# EAGLE design Tasmodul_USB-Dimmer (EAGLE 9.6.2)
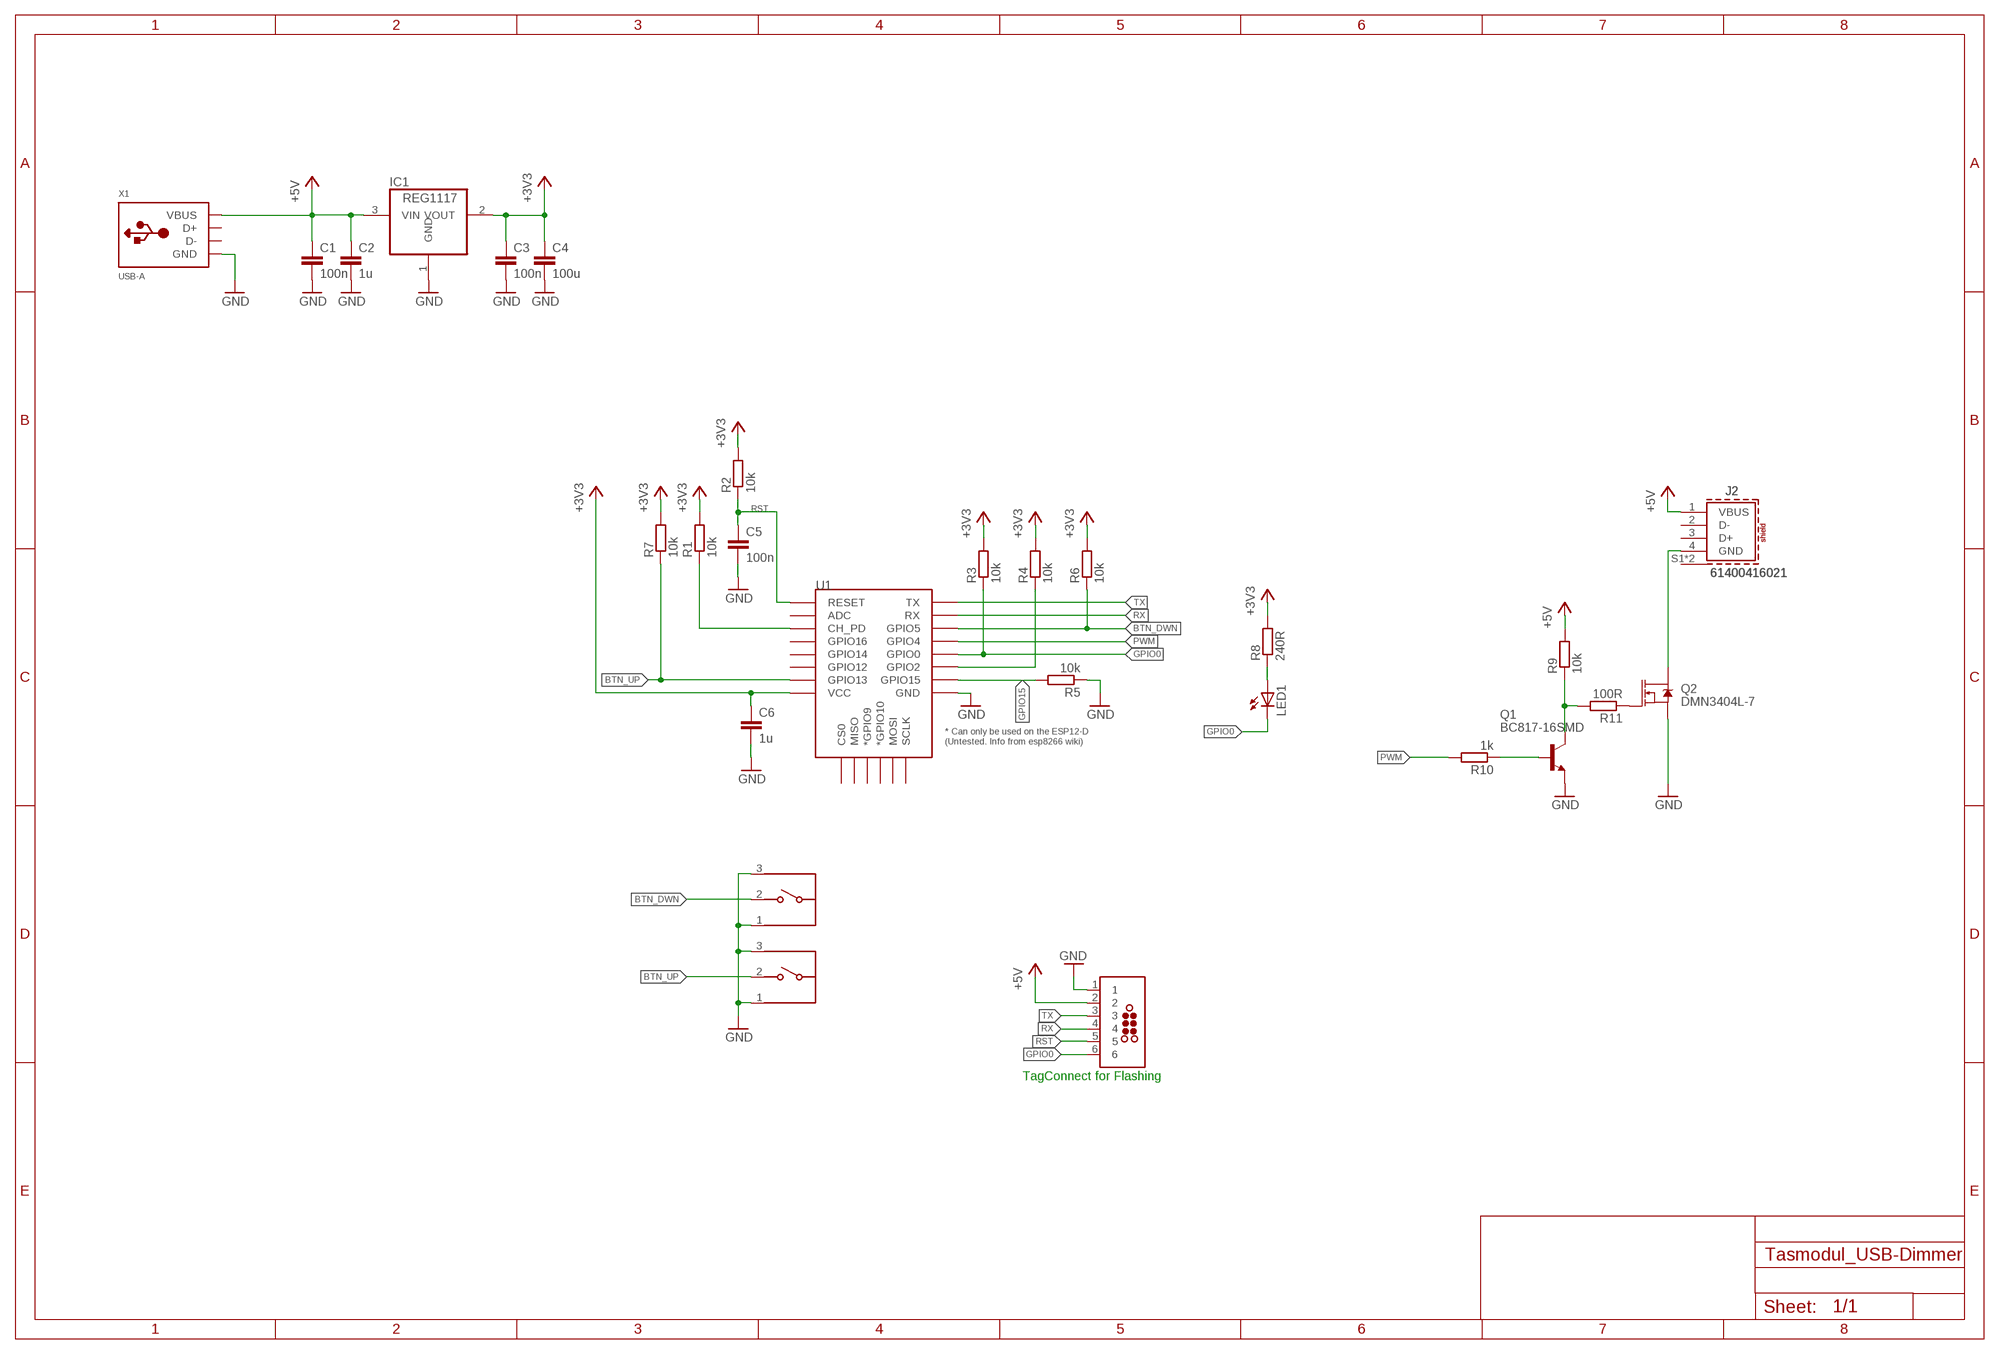
[diagram p0: schematic, sheet 1]

## Parts
C1  100n  C-EUC0603  [C0603]
C2  1u  C-EUC0603  [C0603]
C3  100n  C-EUC0603  [C0603]
C4  100u  C-EUC0603  [C0603]
C5  100n  C-EUC0603  [C0603]
C6  1u  C-EUC0603  [C0603]
IC1  REG1117  [SOT223]
J2  61400416021  61400416021  [61400416021]
J6  TC2030-MCP-NL  [TC2030-MCP-NL]
LED1  LEDCHIP-LED0603  [CHIP-LED0603]
Q1  BC817-16SMD  [SOT23-BEC]
Q2  DMN3404L-7  MOSFET-NCH-AO3404A  [SOT23-3]
R1  10k  R-EU_R0603  [R0603]
R2  10k  R-EU_R0603  [R0603]
R3  10k  R-EU_R0603  [R0603]
R4  10k  R-EU_R0603  [R0603]
R5  10k  R-EU_R0603  [R0603]
R6  10k  R-EU_R0603  [R0603]
R7  10k  R-EU_R0603  [R0603]
R8  240R  R-EU_R0603  [R0603]
R9  10k  R-EU_R0603  [R0603]
R10  1k  R-EU_R0603  [R0603]
R11  100R  R-EU_R0603  [R0603]
S1  436333033816  [436333033816]
S2  436333033816  [436333033816]
U1  ESP12ESMD  [ESP12E-SMD]
X1  USB-A  [MOLEX_480371000]

## Nets
+3V3: C3.1 C4.1 C6.1 IC1.2(VOUT) R1.2 R2.2 R3.2 R4.2 R6.2 R7.2 R8.2 U1.VCC
+5V: C1.1 C2.1 IC1.3(VIN) J2.1(VBUS) J6.2 R9.2 X1.1(VBUS)
BTN_DWN: R6.1 S2.2 U1.GPIO5
BTN_UP: R7.1 S1.2 U1.GPIO13
GND: C1.2 C2.2 C3.2 C4.2 C5.2 C6.2 IC1.1(GND) J6.1 Q1.E Q2.2(S) R5.1 S1.1 S1.3 S2.1 S2.3 U1.GND X1.4(GND)
GPIO0: J6.6 LED1.C R3.1 U1.GPIO0
GPIO15: R5.2 U1.GPIO15
N$1: LED1.A R8.1
N$3: Q2.1(G) R11.1
N$4: Q1.B R10.1
N$5: R1.1 U1.CH_PD
N$7: R4.1 U1.GPIO2
N$8: Q1.C R9.1 R11.2
N$9: J2.4(GND) Q2.3(D)
PWM: R10.2 U1.GPIO4
RST: C5.1 J6.5 R2.1 U1.RESET
RX: J6.4 U1.RXD0(RX)
TX: J6.3 U1.TXD0(TX)
Unconnected: J2.2(D-) J2.3(D+) J2.S1(SHIELD) J2.S2(SHIELD) U1.ADC U1.CS0 U1.GPIO9(*GPIO9) U1.GPIO10(*GPIO10) U1.GPIO12 U1.GPIO14 U1.GPIO16 U1.MISO U1.MOSI U1.SCLK X1.2(D-) X1.3(D+)

## Notes on the sheet
- TagConnect for Flashing

## Library data of the parts
C1-C6 = rcl:C-EU: CAPACITOR, European symbol
IC1 = burr-brown:REG1117: 800mA and 1A Low Dropout (LDO) Positive Regulator 1.8V, 2.5V, 2.85V, 3.3V, 5V, and Adj; MPN: REG1117; OC_FARNELL: 1097566; OC_NEWARK: 14P6981
J2 = Wurth_Connectors_WR-USB:61400416021: WR-COM USB 2.0 Type A Horizontal Kind Properties Durability:1 500 Mating cycles Quality Class:1 500 Mating cycles Connector Type:USB Gender:Receptacle Type:Horizontal General Information Operating Temperature:-40up to +105 °C Compliance:RoHS Electrical Properties IR 1:1.5 A Working Voltage:30V (AC) Withstanding Voltage:750 V (AC) Contact Resistance:20 mΩ Material Properties Insulator Material:PBT Insulator Flammability Rating:UL94 V-0 Color:White Cover Material:Brass Cover Plating:Nickel Contact Material:Copper Alloy Contact Plating:Selective Gold Contact Type:Stamped Shielding Material:Brass Shielding Plating:Nickel <https://www.we-online.com/catalog/media/o32983v209%20Family_WR-COM_61400416021.jpg> Details see: https://www.we-online.com/catalog/en/COM_TYPE_A_HORIZONTAL/ Updated by Yingchun, Shan 2020-01-14 2020 (C) Würth Elektronik; APPLICATION: USB 2.0; DATASHEET-URL: https://www.we-online.com/redexpert/spec/61400416021?ae; GERDER: Receptacle; INTERFACE-TYPE: Type A; IR: 1.5A; MOUNT: THT; PACKAGING: Tray; PART-NUMBER: 61400416021; PINS: 4; TYPE: Horizontal; WORKING-VOLTAGE: 30V(AC)
J6 = tag-connect:TC2030: TAG-CONNECT ICSP Connector Manufacturer: Tag-Connect <http://www.tag-connect.com> Cable for easy In-Circuit Serial Programming. Designed for Microchip ICD2, suitable for many others. Two variants - one "with legs" (for hands-free fit on PCB) and another "without legs" for quick programming. PAD Description 1 MCLR/Vpp 2 Vdd 3 GND 4 PGD (ISPDAT) 5 PGC (ISPCLK) 6 nc (used for LVP) ©2009 ROFA.cz - modified and updated by Robert Darlington ‹rdarlington@gmail.com›
LED1 = led:LED: LED OSRAM: - CHIPLED LG R971, LG N971, LY N971, LG Q971, LY Q971, LO R971, LY R971 LH N974, LH R974 LS Q976, LO Q976, LY Q976 LO Q996 - Hyper CHIPLED LW Q18S LB Q993, LB Q99A, LB R99A - SideLED LS A670, LO A670, LY A670, LG A670, LP A670 LB A673, LV A673, LT A673, LW A673 LH A674 LY A675 LS A676, LA A676, LO A676, LY A676, LW A676 LS A679, LY A679, LG A679 - Hyper Micro SIDELED® LS Y876, LA Y876, LO Y876, LY Y876 LT Y87S - SmartLED LW L88C, LW L88S LB L89C, LB L89S, LG L890 LS L89K, LO L89K, LY L89K LS L896, LA L896, LO L896, LY L896 - TOPLED LS T670, LO T670, LY T670, LG T670, LP T670 LSG T670, LSP T670, LSY T670, LOP T670, LYG T670 LG T671, LOG T671, LSG T671 LB T673, LV T673, LT T673, LW T673 LH T674 LS T676, LA T676, LO T676, LY T676, LB T676, LH T676, LSB T676, LW T676 LB T67C, LV T67C, LT T67C, LS T67K, LO T67K, LY T67K, LW E67C LS E67B, LA E67B, LO E67B, LY E67B, LB E67C, LV E67C, LT E67C LW T67C LS T679, LY T679, LG T679 LS T770, LO T770, LY T770, LG T770, LP T770 LB T773, LV T773, LT T773, LW T773 LH T774 LS E675, LA E675, LY E675, LS T675 LS T776, LA T776, LO T776, LY T776, LB T776 LHGB T686 LT T68C, LB T68C - Hyper Mini TOPLED® LB M676 - Mini TOPLED Santana® LG M470 LS M47K, LO M47K, LY M47K Source: http://www.osram.convergy.de LUXEON: - LUMILED® LXK2-PW12-R00, LXK2-PW12-S00, LXK2-PW14-U00, LXK2-PW14-V00 LXK2-PM12-R00, LXK2-PM12-S00, LXK2-PM14-U00 LXK2-PE12-Q00, LXK2-PE12-R00, LXK2-PE12-S00, LXK2-PE14-T00, LXK2-PE14-U00 LXK2-PB12-K00, LXK2-PB12-L00, LXK2-PB12-M00, LXK2-PB14-N00, LXK2-PB14-P00, LXK2-PB14-Q00 LXK2-PR12-L00, LXK2-PR12-M00, LXK2-PR14-Q00, LXK2-PR14-R00 LXK2-PD12-Q00, LXK2-PD12-R00, LXK2-PD12-S00 LXK2-PH12-R00, LXK2-PH12-S00 LXK2-PL12-P00, LXK2-PL12-Q00, LXK2-PL12-R00 Source: www.luxeon.com KINGBRIGHT: KA-3528ASYC Source: www.kingbright.com
Q1 = transistor-npn:BC817*: NPN Transistor
Q2 = SparkFun-DiscreteSemi:MOSFET-NCH: N-channel MOSFETs Voltage controlled devices that allow control of high current outputs. SparkFun Products: SparkFun OpenScale <https://www.sparkfun.com/products/13261> SparkFun Digital Sandbox <https://www.sparkfun.com/products/12651> SparkFun Monster Moto Shield <https://www.sparkfun.com/products/10182> SparkFun MOSFET Power Controller <https://www.sparkfun.com/products/11214>; PROD_ID: TRANS-12988; VALUE: 5.8A/30V/35mΩ
R1-R11 = rcl:R-EU_: RESISTOR, European symbol
S1 S2 = Wurth_Switch_WS-TASU:436333033816: WS-TASU J-Bend SMT Tact Switch with Boss Design 4.5 x 3.4mm side push MATERIAL PROPERTIES Cover Material Copper Alloy PROPERTIES Actuator Material HTN Actuator Flammability Rating UL94 V-0 Actuator Color Black Frame Material HTN Frame Flammability Rating UL94 V-0 Frame Color Black Contact Material Stainless Steel Contact Plating Silver Terminal Material Copper Alloy Terminal Plating Silver VR 12 V (DC) Contact Resistance Initial 500 mΩ Contact Resistance After Life Test 2 Ω RISO 100 MΩ Withstanding Voltage 250 V (AC) Washable No Mechanical Properties Electrical Life 100000 Cycles Stroke (Value) 0.2 mm GENERAL INFORMATION Operating Temperature -40 up to +85 °C Washable No PACKAGING PROPERTIES Packaging Tape and Reel <https://www.we-online.de/katalog/media/o64618v209%20Family_WS-TASU_J-Bend_SMD_Tact_Switch_with_boss_design_436353045816.jpg> Details see: https://www.we-online.de/katalog/en/WS-TASU_J-BEND_SMT_TACT_SWITCH_SIDE_PUSH Updated by Ella Wu 2021-01-25 2021(C) Wurth Elektronik; DATASHEET-URL: https://www.we-online.com/catalog/datasheet/436333033816.pdf; H: 3.3mm; OPERATION-FORCE: 160g; PART-NUMBER: 436333033816
U1 = esp8266modules:ESP12E: ESP12E Module
X1 = adafruit:USB-A: USB type A 'plug' Used for things that can directly connect to a USB port, say USB key

## Board
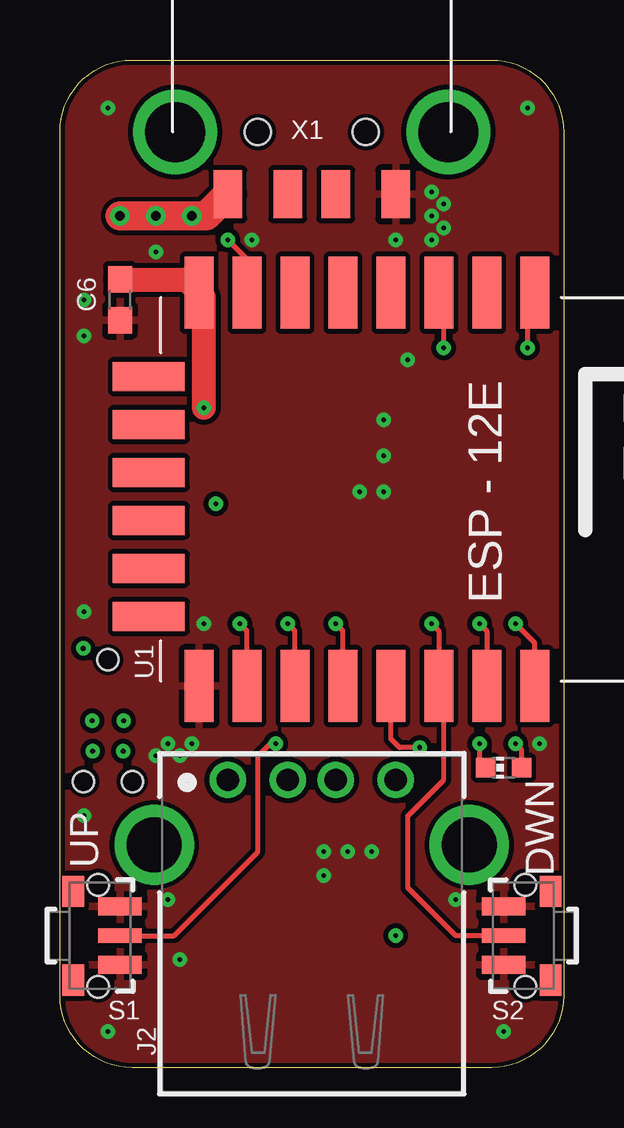
[diagram p1: board, top side]
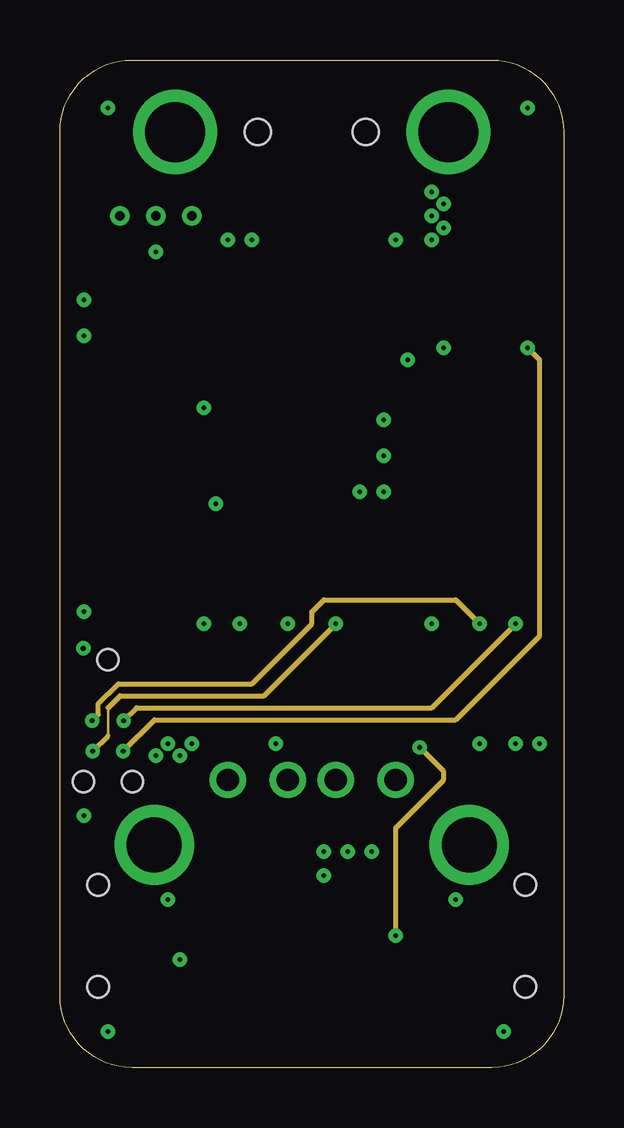
[diagram p2: board, inner layer Route2-SIG]
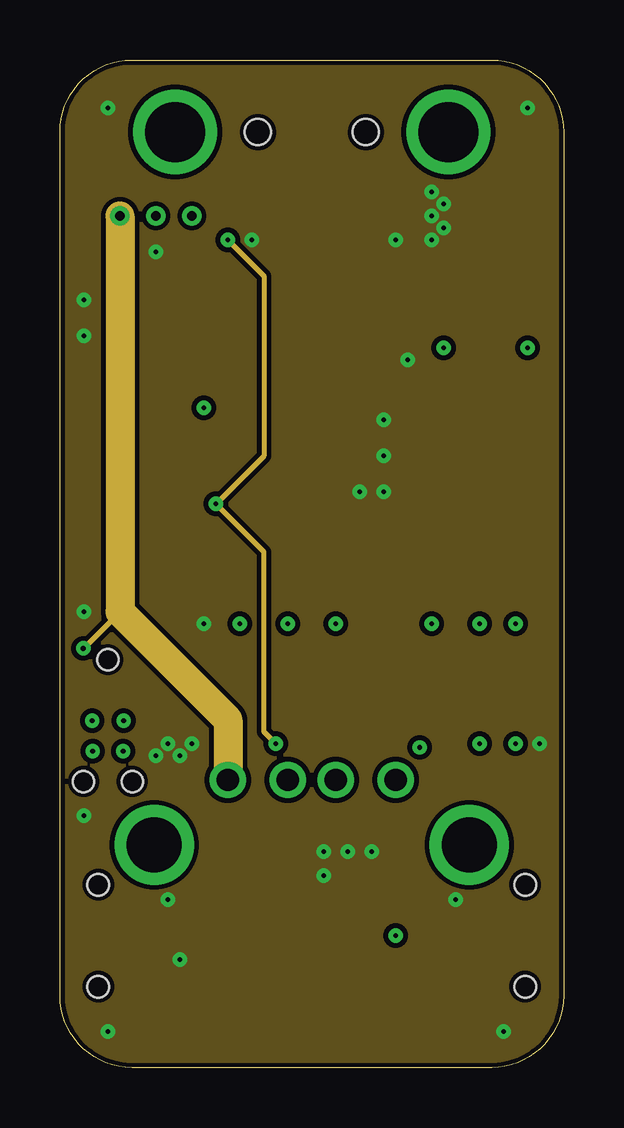
[diagram p3: board, inner layer Route15-PWR]
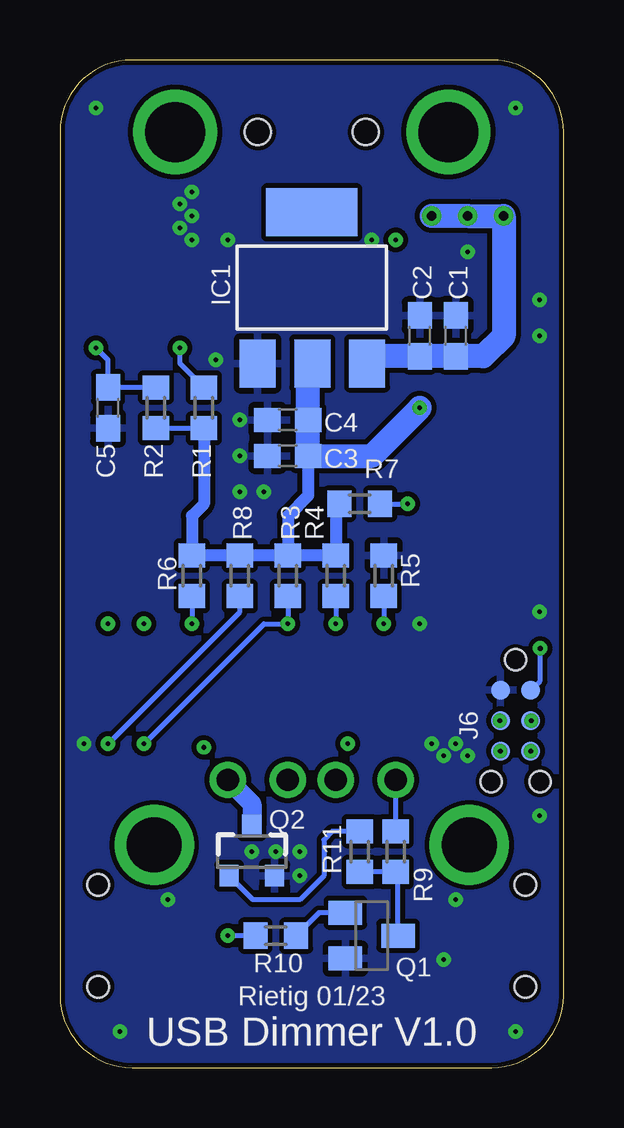
[diagram p4: board, bottom side, seen from below]

Size 21 x 42 mm. Coordinates in mm from the lower left corner, seen from the top.
Outline: 3,42 18,42 arc-90 21,39 21,3 arc-90 18,0 3,0 arc-90 0,3 0,39 arc-90 3,42
Copper layers (1+2*15+16): Top 0.035mm / dielectric 0.2mm / Route2-SIG 0.0175mm / dielectric 1.065mm / Route15-PWR 0.0175mm / dielectric 0.2mm / Bottom 0.035mm
Design rules "jlcpcb-4layers_seb *": minimum track width 3.5mil, minimum drill 0.2mm, track to track 8mil, track to pad 0.2mm, pad to pad 5mil, via to via 10mil, smd to smd 0mil, copper to edge 0.2mm, drill to drill 8mil, minimum pad ring 0.3mm, minimum via ring 0.2mm, stop-mask expansion 2mil, vias tented up to drill 20mil, thermal gap 10mil

### Footprints (pad centres in the part's own frame; a part is rotated, then mirrored left to right if it is on the bottom)
C0603 = smd 1.1 x 1: 1 -0.85,0; 2 0.85,0
SOT223 = smd 1.499 x 2.007: 1 -2.261,-3.15; 2 0.025,-3.15; 3 2.311,-3.15 | smd 3.81 x 2.007: 4 0,3.15
61400416021 = drill 0.92: 1 -3.5,5.99; 2 -1,5.99; 3 1,5.99; 4 3.5,5.99 | drill 2.3: S1 -6.57,3.28; S2 6.57,3.28
TC2030-MCP-NL = smd 0.787 x 0.787: 1 1.27,-0.635; 2 1.27,0.635; 3 2.54,-0.635; 4 2.54,0.635; 5 3.81,-0.635; 6 3.81,0.635 | hole 0.889: 0,0; 5.08,-1.016; 5.08,1.016
CHIP-LED0603 = smd 0.8 x 0.8: A 0,-0.75; C 0,0.75
SOT23-BEC = smd 1 x 1.4: B -0.95,-1.1; C 0,1.1; E 0.95,-1.1
SOT23-3 = smd 0.8 x 0.9: 1 -0.95,-1; 2 0.95,-1; 3 0,1.1
R0603 = smd 1 x 1.1: 1 -0.85,0; 2 0.85,0
436333033816 = smd 0.75 x 1.8: 1 -1.225,0.9; 3 1.225,0.9 | smd 0.6 x 1.8: 2 0,0.9 | smd 1.3 x 0.9: Z1 -1.85,-1.05; Z2 1.85,-1.05 | hole 0.9: -2.125,0; 2.125,0
ESP12E-SMD = smd 3 x 1.2: ADC -8.3,3.8; CH_PD -8.3,1.8; GND 8.1,-8.2; GPIO0 8.1,-2.2; GPIO2 8.1,-4.2; GPIO4 8.1,-0.2; GPIO5 8.1,1.8; GPIO12 -8.3,-4.2; GPIO13 -8.3,-6.2; GPIO14 -8.3,-2.2; GPIO15 8.1,-6.2; GPIO16 -8.3,-0.2; RESET -8.3,5.8; RXD0 8.1,3.8; TXD0 8.1,5.8; VCC -8.3,-8.2 | smd 1.2 x 3: CS0 -4.8,-10.3; GPIO9 -0.8,-10.3; GPIO10 1.2,-10.3; MISO -2.8,-10.3; MOSI 3.2,-10.3; SCLK 5.2,-10.3
MOLEX_480371000 = smd 1.2 x 2: 1 3.5,2.6; 2 1,2.6; 3 -1,2.6; 4 -3.5,2.6 | drill 2.5: M1 -5.7,0; M2 5.7,0 | hole 1.1: -2.25,0; 2.25,0

### Placement (x,y rotation side)
C1  4.5,30.5 90 bottom
C2  6,30.5 90 bottom
C3  11.5,25.5 180 bottom
C4  11.5,27 180 bottom
C5  19,27.5 270 bottom
C6  2.5,32 270 top
IC1  10.5,32.5 0 bottom
J2  10.5,6 0 top
J6  2,17 270 bottom
LED1  18.5,12.5 90 top
Q1  8,5.5 270 bottom
Q2  13,9 0 bottom
R1  15,27.5 270 bottom
R2  17,27.5 270 bottom
R3  11.5,20.5 90 bottom
R4  9.5,20.5 90 bottom
R5  7.5,20.5 270 bottom
R6  15.5,20.5 90 bottom
R7  8.5,23.5 180 bottom
R8  13.5,20.5 90 bottom
R9  7,9 90 bottom
R10  12,5.5 180 bottom
R11  8.5,9 270 bottom
S1  1.6,5.5 270 top
S2  19.4,5.5 90 top
U1  14,24 270 top
X1  10.5,39 180 top

### Tracks (layer width: path | path; a pad name or v marks a point on that pad's centre or on a via)
+3V3  (via drill 0.2)
  Top 1: v6,27.5 6,32.1 U1.VCC 5.25,32.85 C6.1
  Bottom 0.2: R2.2 R1.2
  Bottom 0.5: R3.2 R4.2 9.5,23.35 R7.2 | R3.2 R8.2 R6.2 15.5,23 15,23.5 R1.2 | C3.1 10.65,23.85 11.5,23 R3.2
  Bottom 1: IC1.2 10.65,29.18 C4.1 C3.1 8,25.5 v6,27.5
+5V  (via drill 0.2, 0.4)
  Top 1.2: X1.1 6.1,35.5 v2.5,35.5
  Route15-PWR 0.2: v0.97,17.47 0.98,17.47 2.5,18.99
  Route15-PWR 1.2: v2.5,35.5 2.5,18.99 7,14.49 J2.1
  Bottom 0.2: J6.2 0.97,16.12 v0.97,17.47 | R9.2 J2.1
  Bottom 1: IC1.3 7.89,29.65 C2.1 C1.1 3.35,29.65 2.5,30.5 v2.5,35.5 v4,35.5 v5.5,35.5
BTN_DWN  (via drill 0.2)
  Top 0.2: S2.2 16.5,5.5 14.5,7.5 14.5,10.5 16,12 16,15.7 U1.GPIO5 15.8,18.2 v15.5,18.5
  Bottom 0.2: R6.1 v15.5,18.5
BTN_UP  (via drill 0.2)
  Top 0.2: S1.2 4.75,5.5 8.25,9 8.25,13 8.75,13.5 v9,13.5 | v7,34.5 7.8,33.7 U1.GPIO13
  Route15-PWR 0.2: v9,13.5 8.5,14 8.5,21.5 v6.5,23.5 8.5,25.5 8.5,33 v7,34.5
  Bottom 0.2: R7.1 v6.5,23.5
GND  (via drill 0.2)
  other vias: 15.5,36.5 15.5,35.5 13,9 12,9 4,34 8,34.5 14,34.5 11,9 11,8 1,10.5 1,19 6,18.5 5,13 4,13 4.5,7 16.5,7 13.5,27 13.5,25.5 14.5,29.5 12.5,24 13.5,24 1,32 1,30.5 4.5,13.5 5.5,13.5 5,4.5 2,1.5 18.5,1.5 20,13.5 19.5,40 2,40 15.5,34.5 16,36 16,35
  pour Top: 3,0 18,0 arc90 21,3 21,39 arc90 18,42 3,42 arc90 0,39 0,3 arc90
  pour Bottom: 0,3 0,39 arc-90 3,42 18,42 arc-90 21,39 21,3 arc-90 18,0 3,0 arc-90
  pour Route15-PWR: 0,42 21,42 21,0 0,0
GPIO0  (via drill 0.2)
  Top 0.2: U1.GPIO0 11.8,18.2 v11.5,18.5 | LED1.C 17.5,12.75 v17.5,13.5
  Route2-SIG 0.1: 2,13.82 2,15
  Route2-SIG 0.2: J6.6 2,13.82 | 2,15 2.5,15.5 8.5,15.5 v11.5,18.5
  Bottom 0.2: R3.1 v11.5,18.5 12.5,18.5 v17.5,13.5
  other vias: 1.36,13.19
GPIO15  (via drill 0.2)
  Top 0.2: U1.GPIO15 7.8,18.2 v7.5,18.5
  Bottom 0.2: R5.2 v7.5,18.5
N$1  (via drill 0.2)
  Top 0.2: LED1.A 19.25,13.25 v19,13.5
  Bottom 0.2: v19,13.5 13.5,19 R8.1
N$3
  Bottom 0.2: R11.1 9.65,9.85 10,9.5 10,8 11,7 12.95,7 Q2.1
N$4
  Bottom 0.2: Q1.B 10.2,6.45 R10.1
N$5  (via drill 0.2)
  Top 0.2: v16,30 16,32.1 U1.CH_PD
  Bottom 0.2: R1.1 16,29.35 v16,30
N$7  (via drill 0.2)
  Top 0.2: U1.GPIO2 9.8,18.2 v9.5,18.5
  Bottom 0.2: R4.1 v9.5,18.5
N$8
  Bottom 0.2: Q1.C 6.9,8.05 R9.1 R11.2
N$9
  Bottom 0.8: J2.4 13,10.99 Q2.3
PWM  (via drill 0.2)
  Top 0.2: v15,13.34 14.16,13.34 13.8,13.7 U1.GPIO4
  Route2-SIG 0.2: v14,5.5 14,10 16,12 16,12.34 v15,13.34
  Bottom 0.2: R10.2 v14,5.5
RST  (via drill 0.2)
  Top 0.2: v19.5,30 19.5,32 U1.RESET
  Route2-SIG 0.2: J6.5 3.95,14.5 16.5,14.5 20,18 20,29.5 v19.5,30
  Bottom 0.2: R2.1 C5.1 19,29.5 v19.5,30
  other vias: 2.63,13.19
RX  (via drill 0.2)
  Top 0.2: v17.5,18.5 17.8,18.2 U1.RXD0
  Route2-SIG 0.2: v1.34,14.46 1.6,14.71 1.6,15.17 2.43,16 8,16 10.5,18.5 10.5,19 11,19.5 16.5,19.5 v17.5,18.5
  Bottom 0.2: J6.4 v1.34,14.46
TX  (via drill 0.2)
  Top 0.2: U1.TXD0 19.8,17.7 v19,18.5
  Route2-SIG 0.2: v2.66,14.46 3.2,15 15.5,15 v19,18.5
  Bottom 0.2: J6.3 v2.66,14.46

### Text on the board
tPlace: DWN | UP
bPlace: Rietig 01/23 | USB Dimmer V1.0